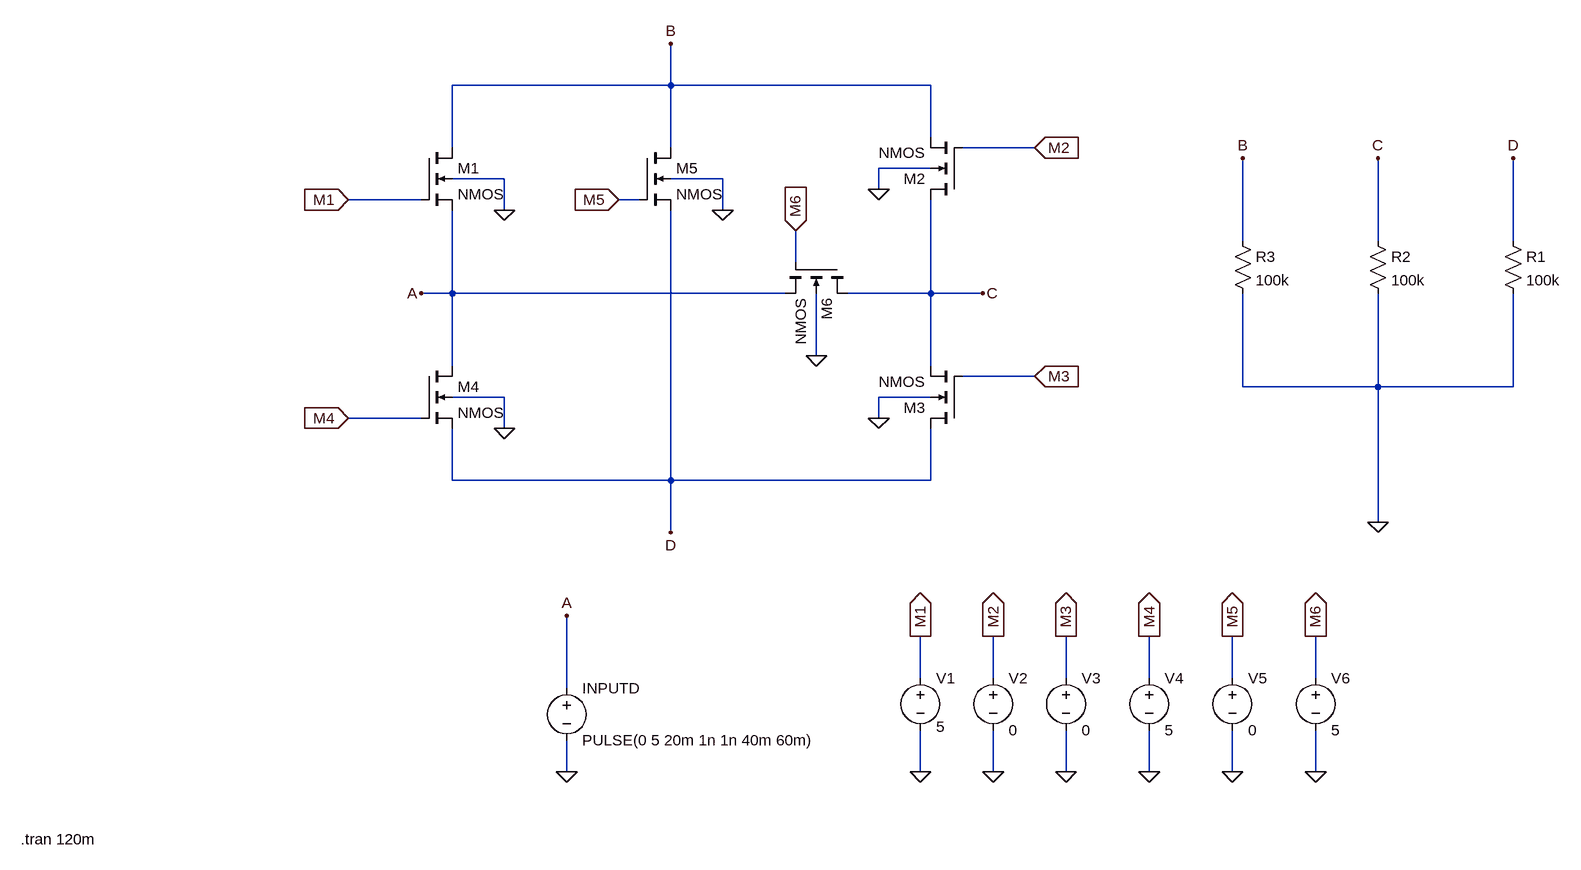
[diagram p0: schematic circuit2_part2.asc]
circuit2_part2.asc, the LTspice schematic file:
Version 4
SHEET 1 1964 1220
WIRE 64 -192 64 -256
WIRE 64 -192 -272 -192
WIRE 464 -192 64 -192
WIRE 464 -112 464 -192
WIRE -272 -96 -272 -192
WIRE 64 -96 64 -192
WIRE 624 -96 512 -96
WIRE 464 -64 384 -64
WIRE -192 -48 -272 -48
WIRE 144 -48 64 -48
WIRE 384 -32 384 -64
WIRE -320 -16 -432 -16
WIRE 16 -16 -16 -16
WIRE -192 0 -192 -48
WIRE 144 0 144 -48
WIRE 944 48 944 -80
WIRE 1152 48 1152 -80
WIRE 1360 48 1360 -80
WIRE 256 80 256 32
WIRE -272 128 -272 0
WIRE -272 128 -320 128
WIRE 240 128 -272 128
WIRE 464 128 464 -16
WIRE 464 128 336 128
WIRE 544 128 464 128
WIRE 288 224 288 128
WIRE -272 240 -272 128
WIRE 464 240 464 128
WIRE 624 256 512 256
WIRE 944 272 944 128
WIRE 1152 272 1152 128
WIRE 1152 272 944 272
WIRE 1360 272 1360 128
WIRE 1360 272 1152 272
WIRE -192 288 -272 288
WIRE 464 288 384 288
WIRE -320 320 -432 320
WIRE 384 320 384 288
WIRE -192 336 -192 288
WIRE -272 416 -272 336
WIRE 64 416 64 0
WIRE 64 416 -272 416
WIRE 464 416 464 336
WIRE 464 416 64 416
WIRE 1152 480 1152 272
WIRE 64 496 64 416
WIRE 448 720 448 656
WIRE 560 720 560 656
WIRE 672 720 672 656
WIRE 800 720 800 656
WIRE 928 720 928 656
WIRE 1056 720 1056 656
WIRE -96 736 -96 624
WIRE -96 864 -96 816
WIRE 448 864 448 800
WIRE 560 864 560 800
WIRE 672 864 672 800
WIRE 800 864 800 800
WIRE 928 864 928 800
WIRE 1056 864 1056 800
FLAG -96 864 0
FLAG -192 0 0
FLAG 1152 480 0
FLAG 384 320 0
FLAG 384 -32 0
FLAG 144 0 0
FLAG -192 336 0
FLAG 288 224 0
FLAG 1360 -80 D
FLAG 944 -80 B
FLAG 448 656 M1
IOPIN 448 656 Out
FLAG 560 656 M2
IOPIN 560 656 Out
FLAG 672 656 M3
IOPIN 672 656 Out
FLAG 800 656 M4
IOPIN 800 656 Out
FLAG 928 656 M5
IOPIN 928 656 Out
FLAG 1056 656 M6
IOPIN 1056 656 Out
FLAG -432 -16 M1
IOPIN -432 -16 In
FLAG -16 -16 M5
IOPIN -16 -16 In
FLAG 624 -96 M2
IOPIN 624 -96 In
FLAG 624 256 M3
IOPIN 624 256 In
FLAG 256 32 M6
IOPIN 256 32 In
FLAG -432 320 M4
IOPIN -432 320 In
FLAG -96 624 A
FLAG -320 128 A
FLAG 64 -256 B
FLAG 64 496 D
FLAG 544 128 C
FLAG 448 864 0
FLAG 560 864 0
FLAG 672 864 0
FLAG 800 864 0
FLAG 928 864 0
FLAG 1056 864 0
FLAG 1152 -80 C
SYMBOL voltage 448 704 R0
WINDOW 3 24 91 Left 2
WINDOW 123 0 0 Left 0
WINDOW 39 0 0 Left 0
SYMATTR Value 5
SYMATTR InstName V1
SYMBOL voltage 560 704 R0
WINDOW 123 0 0 Left 0
WINDOW 39 0 0 Left 0
SYMATTR InstName V2
SYMATTR Value 0
SYMBOL nmos4 -320 -96 R0
SYMATTR InstName M1
SYMATTR Value2 l=10u w=100u
SYMBOL res 1344 32 R0
SYMATTR InstName R1
SYMATTR Value 100k
SYMBOL nmos4 512 -16 R180
SYMATTR InstName M2
SYMATTR Value2 l=10u w=100u
SYMBOL nmos4 512 336 R180
SYMATTR InstName M3
SYMATTR Value2 l=10u w=100u
SYMBOL nmos4 -320 240 R0
SYMATTR InstName M4
SYMATTR Value2 l=10u w=100u
SYMBOL nmos4 16 -96 R0
SYMATTR InstName M5
SYMATTR Value2 l=10u w=100u
SYMBOL nmos4 336 80 R90
SYMATTR InstName M6
SYMATTR Value2 l=10u w=100u
SYMBOL res 928 32 R0
SYMATTR InstName R3
SYMATTR Value 100k
SYMBOL voltage 672 704 R0
WINDOW 123 0 0 Left 0
WINDOW 39 0 0 Left 0
SYMATTR InstName V3
SYMATTR Value 0
SYMBOL voltage 800 704 R0
WINDOW 123 0 0 Left 0
WINDOW 39 0 0 Left 0
SYMATTR InstName V4
SYMATTR Value 5
SYMBOL voltage 928 704 R0
WINDOW 123 0 0 Left 0
WINDOW 39 0 0 Left 0
SYMATTR InstName V5
SYMATTR Value 0
SYMBOL voltage 1056 704 R0
WINDOW 123 0 0 Left 0
WINDOW 39 0 0 Left 0
SYMATTR InstName V6
SYMATTR Value 5
SYMBOL voltage -96 720 R0
WINDOW 123 0 0 Left 0
WINDOW 39 0 0 Left 0
SYMATTR InstName INPUTD
SYMATTR Value PULSE(0 5 20m 1n 1n 40m 60m)
SYMBOL res 1136 32 R0
SYMATTR InstName R2
SYMATTR Value 100k
TEXT -936 968 Left 2 !.tran 120m

The netlist it stands for:
* circuit2_part2.asc
V1 M1 0 5
V2 M2 0 0
M1 B M1 A 0 NMOS l=10u w=100u
R1 D 0 100k
M2 C M2 B 0 NMOS l=10u w=100u
M3 D M3 C 0 NMOS l=10u w=100u
M4 A M4 D 0 NMOS l=10u w=100u
M5 B M5 D 0 NMOS l=10u w=100u
M6 C M6 A 0 NMOS l=10u w=100u
R3 B 0 100k
V3 M3 0 0
V4 M4 0 5
V5 M5 0 0
V6 M6 0 5
V§INPUTD A 0 PULSE(0 5 20m 1n 1n 40m 60m)
R2 C 0 100k
.model NMOS NMOS
.model PMOS PMOS
.lib standard.mos
.tran 120m
.backanno
.end